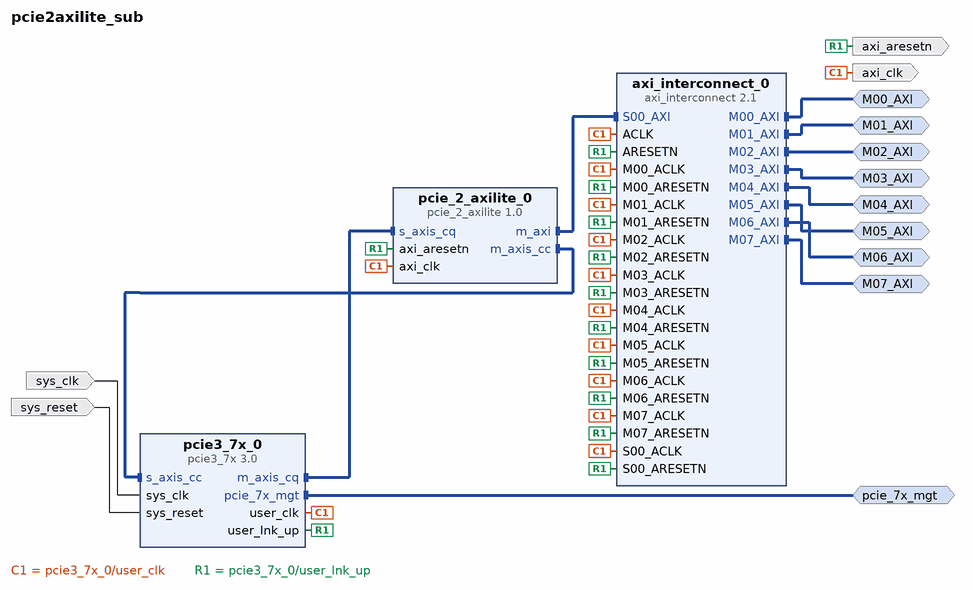
[diagram p0: block diagram of the top level]
# Vivado block design pcie2axilite_sub, Vivado 2014.2
create_bd_design pcie2axilite_sub

create_bd_intf_port -mode Master -vlnv xilinx.com:interface:pcie_7x_mgt_rtl:1.0 pcie_7x_mgt
create_bd_intf_port -mode Master -vlnv xilinx.com:interface:aximm_rtl:1.0 M07_AXI
set_property -dict {CONFIG.DATA_WIDTH 32 CONFIG.PROTOCOL AXI4LITE CONFIG.ADDR_WIDTH 32} [get_bd_intf_ports M07_AXI]
create_bd_intf_port -mode Master -vlnv xilinx.com:interface:aximm_rtl:1.0 M06_AXI
set_property -dict {CONFIG.DATA_WIDTH 32 CONFIG.PROTOCOL AXI4LITE CONFIG.ADDR_WIDTH 32} [get_bd_intf_ports M06_AXI]
create_bd_intf_port -mode Master -vlnv xilinx.com:interface:aximm_rtl:1.0 M05_AXI
set_property -dict {CONFIG.DATA_WIDTH 32 CONFIG.PROTOCOL AXI4LITE CONFIG.ADDR_WIDTH 32} [get_bd_intf_ports M05_AXI]
create_bd_intf_port -mode Master -vlnv xilinx.com:interface:aximm_rtl:1.0 M04_AXI
set_property -dict {CONFIG.DATA_WIDTH 32 CONFIG.PROTOCOL AXI4LITE CONFIG.ADDR_WIDTH 32} [get_bd_intf_ports M04_AXI]
create_bd_intf_port -mode Master -vlnv xilinx.com:interface:aximm_rtl:1.0 M03_AXI
set_property -dict {CONFIG.DATA_WIDTH 32 CONFIG.PROTOCOL AXI4LITE CONFIG.ADDR_WIDTH 32} [get_bd_intf_ports M03_AXI]
create_bd_intf_port -mode Master -vlnv xilinx.com:interface:aximm_rtl:1.0 M02_AXI
set_property -dict {CONFIG.DATA_WIDTH 32 CONFIG.PROTOCOL AXI4LITE CONFIG.ADDR_WIDTH 32} [get_bd_intf_ports M02_AXI]
create_bd_intf_port -mode Master -vlnv xilinx.com:interface:aximm_rtl:1.0 M01_AXI
set_property -dict {CONFIG.DATA_WIDTH 32 CONFIG.PROTOCOL AXI4LITE CONFIG.ADDR_WIDTH 32} [get_bd_intf_ports M01_AXI]
create_bd_intf_port -mode Master -vlnv xilinx.com:interface:aximm_rtl:1.0 M00_AXI
set_property -dict {CONFIG.DATA_WIDTH 32 CONFIG.PROTOCOL AXI4LITE CONFIG.ADDR_WIDTH 32} [get_bd_intf_ports M00_AXI]
create_bd_port -dir I -type clk sys_clk
create_bd_port -dir I -type rst sys_reset
set_property -dict {CONFIG.POLARITY ACTIVE_HIGH} [get_bd_ports sys_reset]
create_bd_port -dir O -type rst axi_aresetn
create_bd_port -dir O -type clk axi_clk
set_property -dict [list \
  CONFIG.ASSOCIATED_BUSIF M00_AXI:M01_AXI:M02_AXI:M03_AXI:M01_AXI:M04_AXI:M05_AXI:M06_AXI:M07_AXI \
] [get_bd_ports axi_clk]

create_bd_cell -type ip -vlnv xilinx.com:ip:axi_interconnect:2.1 axi_interconnect_0
set_property -dict {CONFIG.NUM_MI 8} [get_bd_cells axi_interconnect_0]
create_bd_cell -type ip -vlnv xilinx.com:ip:pcie3_7x:3.0 pcie3_7x_0
set_property -dict [list \
  CONFIG.xlnx_ref_board VC709 \
  CONFIG.PL_LINK_CAP_MAX_LINK_SPEED 8.0_GT/s \
  CONFIG.PL_LINK_CAP_MAX_LINK_WIDTH X8 \
  CONFIG.AXISTEN_IF_RC_STRADDLE true \
  CONFIG.PF0_DEVICE_ID 0007 \
  CONFIG.pf0_bar0_size 8 \
  CONFIG.pf0_bar1_enabled true \
  CONFIG.pf0_bar1_type Memory \
  CONFIG.pf0_bar1_size 4 \
  CONFIG.gen_x0y0 false \
  CONFIG.axisten_if_width 256_bit \
  CONFIG.mode_selection Advanced \
  CONFIG.tx_fc_if false \
  CONFIG.cfg_fc_if false \
  CONFIG.cfg_ext_if false \
  CONFIG.cfg_status_if false \
  CONFIG.per_func_status_if false \
  CONFIG.cfg_mgmt_if false \
  CONFIG.rcv_msg_if false \
  CONFIG.cfg_tx_msg_if false \
  CONFIG.cfg_ctl_if false \
  CONFIG.axisten_freq 250 \
] [get_bd_cells pcie3_7x_0]
create_bd_cell -type ip -vlnv xilinx.com:ip:pcie_2_axilite:1.0 pcie_2_axilite_0
set_property -dict [list \
  CONFIG.BAR1SIZE 0xFFFFFFFFFFF00000 \
  CONFIG.BAR0SIZE 0xFFFFFFFFFFC00000 \
  CONFIG.BAR2AXI1_TRANSLATION 0x0000000001000000 \
  CONFIG.BAR2AXI0_TRANSLATION 0x0000000000000000 \
  CONFIG.AXIS_TDATA_WIDTH 256 \
] [get_bd_cells pcie_2_axilite_0]

# ---- connections ----

connect_bd_intf_net [get_bd_intf_pins pcie3_7x_0/m_axis_cq] [get_bd_intf_pins pcie_2_axilite_0/s_axis_cq]
connect_bd_intf_net [get_bd_intf_pins pcie3_7x_0/s_axis_cc] [get_bd_intf_pins pcie_2_axilite_0/m_axis_cc]
connect_bd_intf_net [get_bd_intf_pins axi_interconnect_0/S00_AXI] [get_bd_intf_pins pcie_2_axilite_0/m_axi]
connect_bd_intf_net [get_bd_intf_ports pcie_7x_mgt] [get_bd_intf_pins pcie3_7x_0/pcie_7x_mgt]
connect_bd_intf_net [get_bd_intf_ports M07_AXI] [get_bd_intf_pins axi_interconnect_0/M07_AXI]
connect_bd_intf_net [get_bd_intf_ports M06_AXI] [get_bd_intf_pins axi_interconnect_0/M06_AXI]
connect_bd_intf_net [get_bd_intf_ports M05_AXI] [get_bd_intf_pins axi_interconnect_0/M05_AXI]
connect_bd_intf_net [get_bd_intf_ports M04_AXI] [get_bd_intf_pins axi_interconnect_0/M04_AXI]
connect_bd_intf_net [get_bd_intf_ports M03_AXI] [get_bd_intf_pins axi_interconnect_0/M03_AXI]
connect_bd_intf_net [get_bd_intf_ports M02_AXI] [get_bd_intf_pins axi_interconnect_0/M02_AXI]
connect_bd_intf_net [get_bd_intf_ports M01_AXI] [get_bd_intf_pins axi_interconnect_0/M01_AXI]
connect_bd_intf_net [get_bd_intf_ports M00_AXI] [get_bd_intf_pins axi_interconnect_0/M00_AXI]
connect_bd_net [get_bd_pins pcie3_7x_0/user_clk] \
  [get_bd_pins axi_interconnect_0/ACLK] [get_bd_pins axi_interconnect_0/M00_ACLK] [get_bd_pins axi_interconnect_0/M01_ACLK] \
  [get_bd_pins axi_interconnect_0/M02_ACLK] [get_bd_pins axi_interconnect_0/M03_ACLK] \
  [get_bd_pins axi_interconnect_0/M04_ACLK] [get_bd_pins axi_interconnect_0/M05_ACLK] \
  [get_bd_pins axi_interconnect_0/M06_ACLK] [get_bd_pins axi_interconnect_0/M07_ACLK] \
  [get_bd_pins axi_interconnect_0/S00_ACLK] [get_bd_pins pcie_2_axilite_0/axi_clk] [get_bd_ports axi_clk]
connect_bd_net [get_bd_pins pcie3_7x_0/user_lnk_up] \
  [get_bd_ports axi_aresetn] [get_bd_pins axi_interconnect_0/ARESETN] [get_bd_pins axi_interconnect_0/M00_ARESETN] \
  [get_bd_pins axi_interconnect_0/M01_ARESETN] [get_bd_pins axi_interconnect_0/M02_ARESETN] \
  [get_bd_pins axi_interconnect_0/M03_ARESETN] [get_bd_pins axi_interconnect_0/M04_ARESETN] \
  [get_bd_pins axi_interconnect_0/M05_ARESETN] [get_bd_pins axi_interconnect_0/M06_ARESETN] \
  [get_bd_pins axi_interconnect_0/M07_ARESETN] [get_bd_pins axi_interconnect_0/S00_ARESETN] \
  [get_bd_pins pcie_2_axilite_0/axi_aresetn]
connect_bd_net [get_bd_ports sys_clk] [get_bd_pins pcie3_7x_0/sys_clk]
connect_bd_net [get_bd_ports sys_reset] [get_bd_pins pcie3_7x_0/sys_reset]

# ---- address map ----
assign_bd_address -offset 0x00000000 -range 4K -target_address_space [get_bd_addr_spaces pcie_2_axilite_0/m_axi] [get_bd_addr_segs M00_AXI/Reg]
assign_bd_address -offset 0x00001000 -range 4K -target_address_space [get_bd_addr_spaces pcie_2_axilite_0/m_axi] [get_bd_addr_segs M01_AXI/Reg]
assign_bd_address -offset 0x00002000 -range 4K -target_address_space [get_bd_addr_spaces pcie_2_axilite_0/m_axi] [get_bd_addr_segs M02_AXI/Reg]
assign_bd_address -offset 0x00003000 -range 4K -target_address_space [get_bd_addr_spaces pcie_2_axilite_0/m_axi] [get_bd_addr_segs M03_AXI/Reg]
assign_bd_address -offset 0x00004000 -range 4K -target_address_space [get_bd_addr_spaces pcie_2_axilite_0/m_axi] [get_bd_addr_segs M04_AXI/Reg]
assign_bd_address -offset 0x00005000 -range 4K -target_address_space [get_bd_addr_spaces pcie_2_axilite_0/m_axi] [get_bd_addr_segs M05_AXI/Reg]
assign_bd_address -offset 0x00006000 -range 4K -target_address_space [get_bd_addr_spaces pcie_2_axilite_0/m_axi] [get_bd_addr_segs M06_AXI/Reg]
assign_bd_address -offset 0x00007000 -range 4K -target_address_space [get_bd_addr_spaces pcie_2_axilite_0/m_axi] [get_bd_addr_segs M07_AXI/Reg]

validate_bd_design
save_bd_design
